# EAGLE schematic trykle (EAGLE 9.6.2)
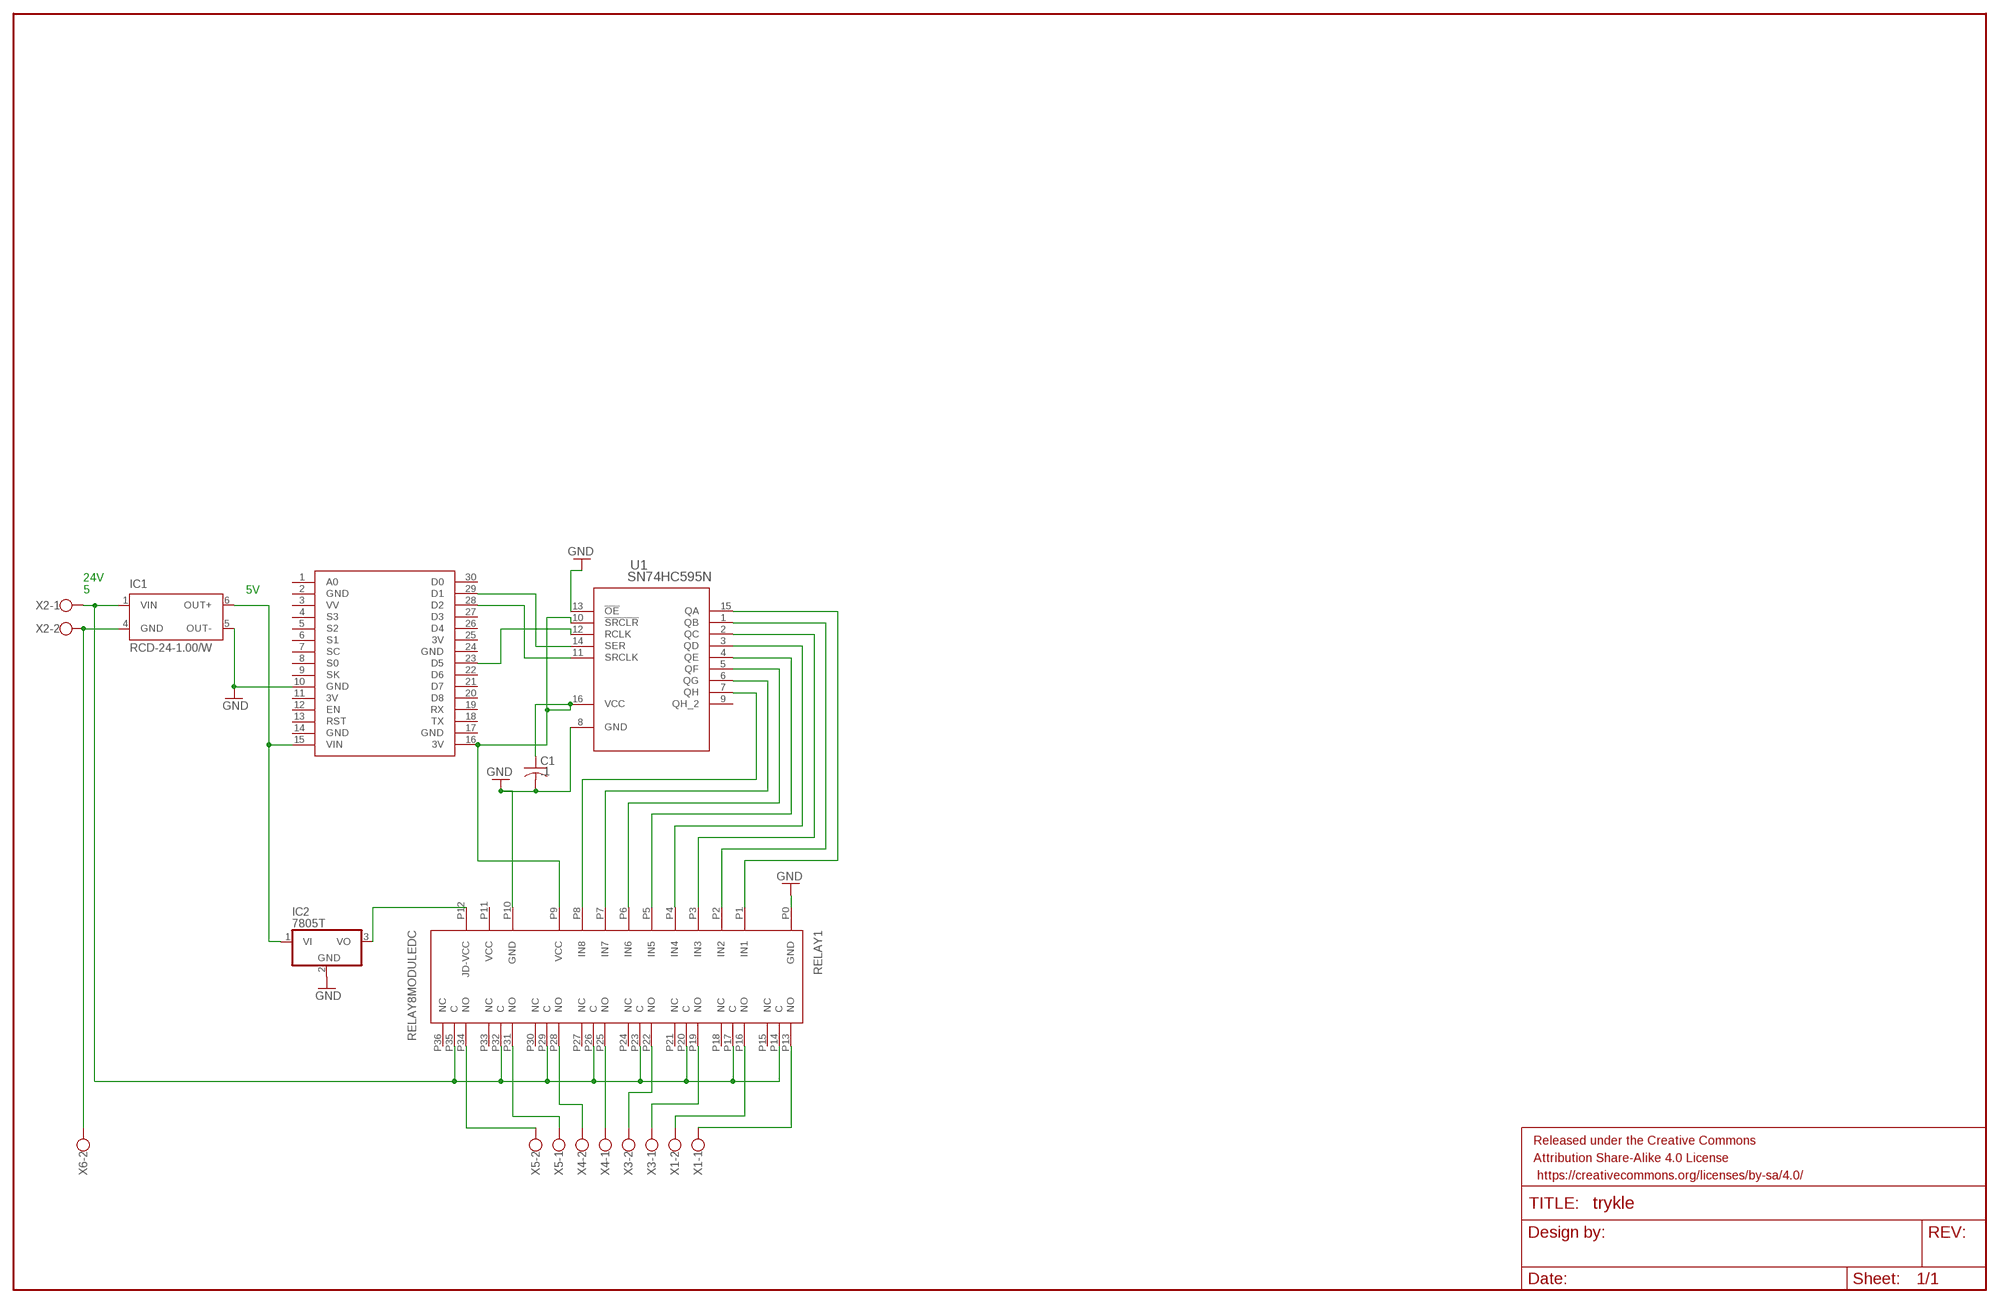
[diagram p0: schematic, sheet 1]

## Parts
C1  .1  C-USC0805  [C0805]
FRAME1  FRAME-LEDGERNO_FOOTPRINT  [DUMMY]
IC1  RCD-24-1.00/W  [RCD-24/W]
IC2  7805T  [TO220H]
RELAY1  RELAY8MODULEDC  [RELAY8MODULEDC]
U1  SN74HC595N  [N16]
U$2  NODEMCU  [NODEMCU]
X1  W237-102  [W237-102]
X2  W237-102  [W237-102]
X3  W237-102  [W237-102]
X4  W237-102  [W237-102]
X5  W237-102  [W237-102]
X6  W237-102  [W237-102]

## Nets
GND: C1.2 IC1.5(OUT-) IC2.2(GND) RELAY1.P0(GND) RELAY1.P10(GND) U1.8(GND) U1.13(!OE) U$2.10(GND)
N$1: IC1.6(OUT+) IC2.1(VI) U$2.15(VIN)
N$2: RELAY1.P1(IN1) U1.15(QA)
N$3: IC2.3(VO) RELAY1.P12(JD-VCC)
N$4: RELAY1.P2(IN2) U1.1(QB)
N$5: RELAY1.P3(IN3) U1.2(QC)
N$6: RELAY1.P4(IN4) U1.3(QD)
N$7: RELAY1.P5(IN5) U1.4(QE)
N$8: RELAY1.P6(IN6) U1.5(QF)
N$9: RELAY1.P7(IN7) U1.6(QG)
N$10: RELAY1.P8(IN8) U1.7(QH)
N$11: C1.1 RELAY1.P9(VCC) U1.10(!SRCLR) U1.16(VCC) U$2.16(3V)
N$12: U1.14(SER) U$2.29(D1)
N$13: U1.11(SRCLK) U$2.28(D2)
N$14: U1.12(RCLK) U$2.23(D5)
N$15: RELAY1.P13(NO) X1.1
N$16: RELAY1.P16(NO) X1.2
N$17: RELAY1.P19(NO) X3.1
N$18: RELAY1.P22(NO) X3.2
N$19: RELAY1.P25(NO) X4.1
N$20: RELAY1.P28(NO) X4.2
N$21: RELAY1.P31(NO) X5.1
N$22: RELAY1.P34(NO) X5.2
N$23: IC1.4(GND) X2.2 X6.2
N$25: IC1.1(VIN) RELAY1.P14(C) RELAY1.P17(C) RELAY1.P20(C) RELAY1.P23(C) RELAY1.P26(C) RELAY1.P29(C) RELAY1.P32(C) RELAY1.P35(C) X2.1
Unconnected: RELAY1.P11(VCC) RELAY1.P15(NC) RELAY1.P18(NC) RELAY1.P21(NC) RELAY1.P24(NC) RELAY1.P27(NC) RELAY1.P30(NC) RELAY1.P33(NC) RELAY1.P36(NC) U1.9(QH_2) U$2.1(A0) U$2.3(VV) U$2.4(S3) U$2.5(S2) U$2.6(S1) U$2.7(SC) U$2.8(S0) U$2.9(SK) U$2.12(EN) U$2.13(RST) U$2.18(TX) U$2.19(RX) U$2.20(D8) U$2.21(D7) U$2.22(D6) U$2.26(D4) U$2.27(D3) U$2.30(D0) X6.1

## Notes on the sheet
- 24V
  5
- 5V

## Power pins joined to a net without a drawn wire
3V: U$2.11(3V) U$2.25(3V)
GND: U$2.2(GND) U$2.14(GND) U$2.17(GND) U$2.24(GND)

## Library data of the parts
C1 = rcl:C-US: CAPACITOR, American symbol; SPICEPREFIX: C
FRAME1 = SparkFun-Aesthetics:FRAME-LEDGER: Schematic Frame - Ledger Standard 11x14 US Ledger frame
IC1 = recom-international:RCD-24*/W: Constant Current Output LED Driver without Dimming Source: http://www.recom-international.de/pdf/Innoline/RCD-24.pdf; OC_FARNELL: unknown; OC_NEWARK: unknown
IC2 = linear:78*: Positive VOLTAGE REGULATOR Source: http://cache.national.com/ds/LM/LM78L05.pdf http://www.fairchildsemi.com/ds/LM/LM7805.pdf
RELAY1 = Relay-8moduleDC:RELAY8MODULEDC
U1 = TI-SN74HC595:SN74HC595N; DATASHEET_URL: http://www.ti.com/lit/gpn/SN74HC595; DESCRIPTION: 8-Bit Shift Registers With 3-State Output Registers; FAMILY_NAME: SHIFT REGISTER; GENERIC_PART_NUMBER: SN74HC595; INDUSTRY_STD_PKG_TYPE: PDIP; MANUFACTURER: Texas Instruments; PACKAGE_DESIGNATOR: N; PIN_COUNT: 16
U$2 = nodemcu:NODEMCU
X1-X6 = con-wago-500:W237-102: WAGO SCREW CLAMP; MPN: 237-102; OC_FARNELL: unknown; OC_NEWARK: 70K9898